# Altium schematic sheet HDMI_OUTPUT_AD9389.SchDoc: HDMI Video Transmitter
size A4; Organization: Altium Limited.; Address1: Level 3, 12a Rodborough Rd; Address2: Frenchs Forest 2086; Address3: NSW; Address4: AUSTRALIA; DocumentNumber: 10; SheetNumber: 10; SheetTotal: 100
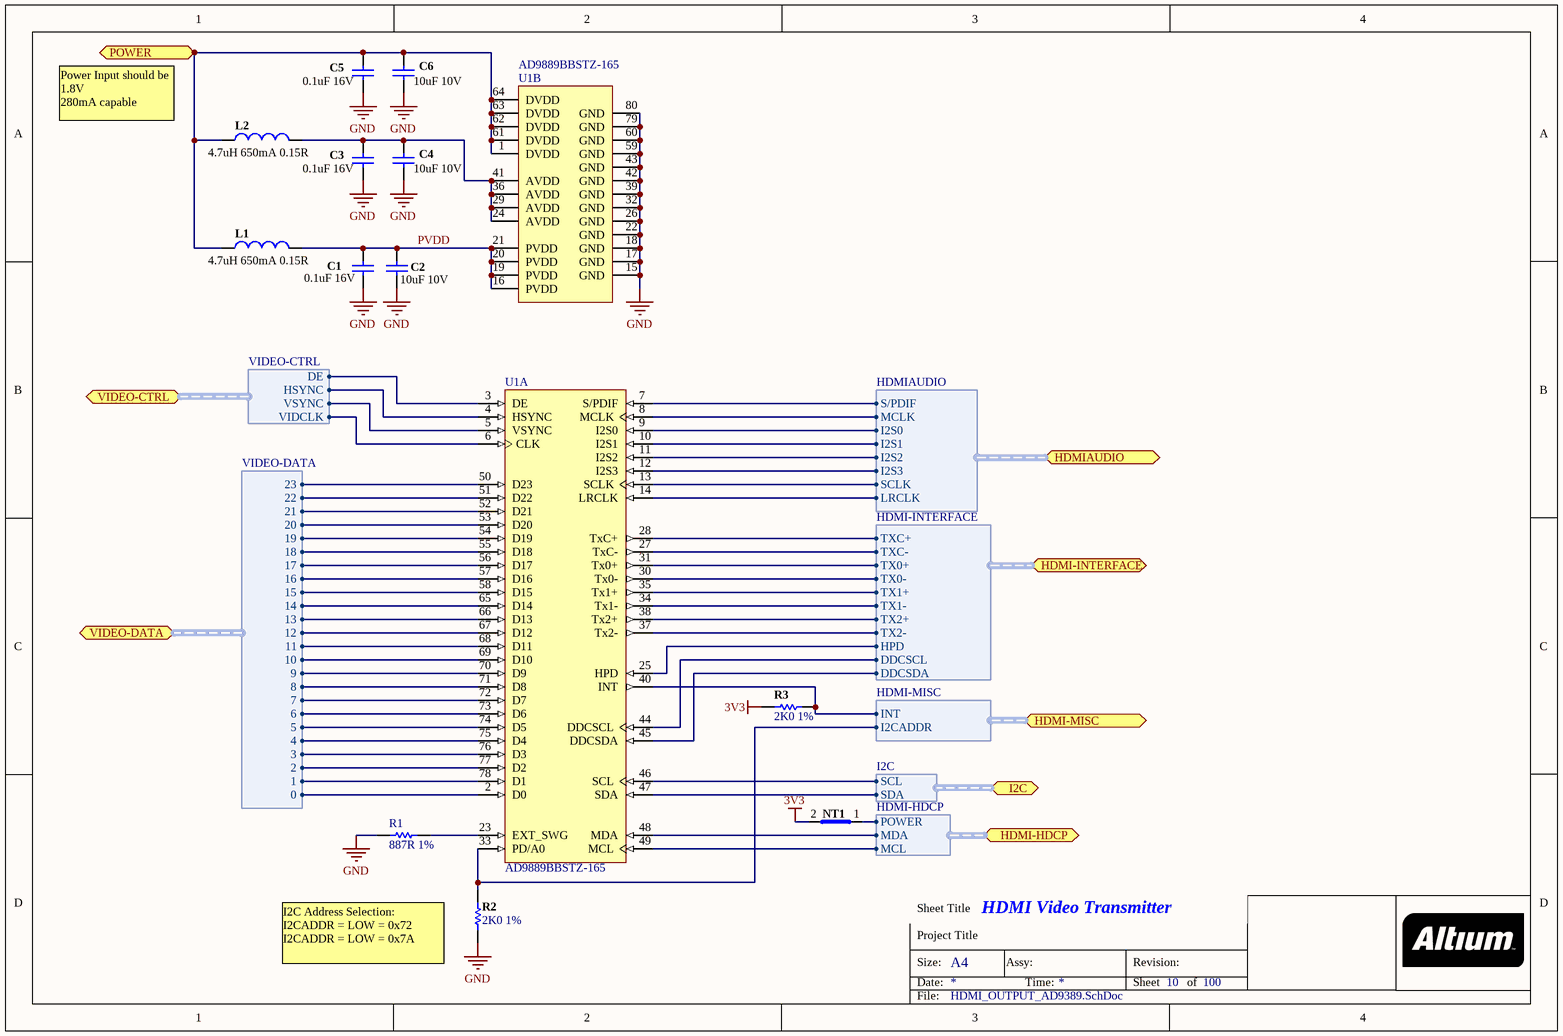
[diagram p0: HDMI_OUTPUT_AD9389.SchDoc]

## Parts
C1  0.1uF 16V  [CAPC1005-STAR]
C2  10uF 10V  [CAPC2012-STAR]
C3  0.1uF 16V  [CAPC1005-STAR]
C4  10uF 10V  [CAPC2012-STAR]
C5  0.1uF 16V  [CAPC1005-STAR]
C6  10uF 10V  [CAPC2012-STAR]
L1  4.7uH 650mA 0.15R  [INDC3225]
L2  4.7uH 650mA 0.15R  [INDC3225]
NT1  Net Tie SMT2  [NETTIE-SMT2-31X39]  (value not drawn)  (net tie, no BOM)
R1  887R 1%  [RESC1005-STAR]
R2  2K0 1%  [RESC1005-STAR]
R3  2K0 1%  [RESC1005-STAR]
U1  AD9889BBSTZ-165  [ST-80-2_V]  (parts A,B of 2)

## Ports
HDMI-HDCP (harness HDMI-HDCP), HDMI-INTERFACE (harness HDMI-INTERFACE), HDMI-MISC (harness HDMI-MISC), HDMIAUDIO (harness HDMIAUDIO), I2C (harness I2C), POWER, VIDEO-CTRL (harness VIDEO-CTRL), VIDEO-DATA (harness VIDEO-DATA)

## Harnesses
I2C: SCL, SDA
HDMIAUDIO: I2S0, I2S1, I2S2, I2S3, LRCLK, MCLK, S/PDIF, SCLK
VIDEO-CTRL: DE, HSYNC, VIDCLK, VSYNC
VIDEO-DATA: 0, 1, 10, 11, 12, 13, 14, 15, 16, 17, 18, 19, 2, 20, 21, 22, 23, 3, 4, 5, 6, 7, 8, 9
HDMI-INTERFACE: TX0+, TX0-, TX1+, TX1-, TX2+, TX2-, TXC+, TXC-, DDCSDA, DDCSCL, HPD
HDMI-MISC: INT, I2CADDR
HDMI-HDCP: POWER, MCL, MDA

## Nets
3V3: NT1.2(Net2) R3.1
GND: C1.2 C2.2 C3.2 C4.2 C5.2 C6.2 R1.1 R2.2 U1.15(GND) U1.17(GND) U1.18(GND) U1.22(GND) U1.26(GND) U1.32(GND) U1.39(GND) U1.42(GND) U1.43(GND) U1.59(GND) U1.60(GND) U1.79(GND) U1.80(GND)
POWER: C5.1 C6.1 L1.1 L2.1 U1.1(DVDD) U1.61(DVDD) U1.62(DVDD) U1.63(DVDD) U1.64(DVDD) ; port POWER
PVDD: C1.1 C2.1 L1.2 U1.16(PVDD) U1.19(PVDD) U1.20(PVDD) U1.21(PVDD)
NetC3_1: C3.1 C4.1 L2.2 U1.24(AVDD) U1.29(AVDD) U1.36(AVDD) U1.41(AVDD)
NetNT1_1: NT1.1(Net1) ; port HDMI-HDCP.POWER
NetR1_2: R1.2 U1.23(EXT_SWG)
NetR2_1: R2.1 U1.33(PD/A0) ; port HDMI-MISC.I2CADDR
NetR3_2: R3.2 U1.40(INT) ; port HDMI-MISC.INT
NetU1_2: U1.2(D0) ; port VIDEO-DATA.0
NetU1_3: U1.3(DE) ; port VIDEO-CTRL.DE
NetU1_4: U1.4(HSYNC) ; port VIDEO-CTRL.HSYNC
NetU1_5: U1.5(VSYNC) ; port VIDEO-CTRL.VSYNC
NetU1_6: U1.6(CLK) ; port VIDEO-CTRL.VIDCLK
NetU1_7: U1.7(S/PDIF) ; port HDMIAUDIO.S/PDIF
NetU1_8: U1.8(MCLK) ; port HDMIAUDIO.MCLK
NetU1_9: U1.9(I2S0) ; port HDMIAUDIO.I2S0
NetU1_10: U1.10(I2S1) ; port HDMIAUDIO.I2S1
NetU1_11: U1.11(I2S2) ; port HDMIAUDIO.I2S2
NetU1_12: U1.12(I2S3) ; port HDMIAUDIO.I2S3
NetU1_13: U1.13(SCLK) ; port HDMIAUDIO.SCLK
NetU1_14: U1.14(LRCLK) ; port HDMIAUDIO.LRCLK
NetU1_25: U1.25(HPD) ; port HDMI-INTERFACE.HPD
NetU1_27: U1.27(TxC-) ; port HDMI-INTERFACE.TXC-
NetU1_28: U1.28(TxC+) ; port HDMI-INTERFACE.TXC+
NetU1_30: U1.30(Tx0-) ; port HDMI-INTERFACE.TX0-
NetU1_31: U1.31(Tx0+) ; port HDMI-INTERFACE.TX0+
NetU1_34: U1.34(Tx1-) ; port HDMI-INTERFACE.TX1-
NetU1_35: U1.35(Tx1+) ; port HDMI-INTERFACE.TX1+
NetU1_37: U1.37(Tx2-) ; port HDMI-INTERFACE.TX2-
NetU1_38: U1.38(Tx2+) ; port HDMI-INTERFACE.TX2+
NetU1_44: U1.44(DDCSCL) ; port HDMI-INTERFACE.DDCSCL
NetU1_45: U1.45(DDCSDA) ; port HDMI-INTERFACE.DDCSDA
NetU1_46: U1.46(SCL) ; port I2C.SCL
NetU1_47: U1.47(SDA) ; port I2C.SDA
NetU1_48: U1.48(MDA) ; port HDMI-HDCP.MDA
NetU1_49: U1.49(MCL) ; port HDMI-HDCP.MCL
NetU1_50: U1.50(D23) ; port VIDEO-DATA.23
NetU1_51: U1.51(D22) ; port VIDEO-DATA.22
NetU1_52: U1.52(D21) ; port VIDEO-DATA.21
NetU1_53: U1.53(D20) ; port VIDEO-DATA.20
NetU1_54: U1.54(D19) ; port VIDEO-DATA.19
NetU1_55: U1.55(D18) ; port VIDEO-DATA.18
NetU1_56: U1.56(D17) ; port VIDEO-DATA.17
NetU1_57: U1.57(D16) ; port VIDEO-DATA.16
NetU1_58: U1.58(D15) ; port VIDEO-DATA.15
NetU1_65: U1.65(D14) ; port VIDEO-DATA.14
NetU1_66: U1.66(D13) ; port VIDEO-DATA.13
NetU1_67: U1.67(D12) ; port VIDEO-DATA.12
NetU1_68: U1.68(D11) ; port VIDEO-DATA.11
NetU1_69: U1.69(D10) ; port VIDEO-DATA.10
NetU1_70: U1.70(D9) ; port VIDEO-DATA.9
NetU1_71: U1.71(D8) ; port VIDEO-DATA.8
NetU1_72: U1.72(D7) ; port VIDEO-DATA.7
NetU1_73: U1.73(D6) ; port VIDEO-DATA.6
NetU1_74: U1.74(D5) ; port VIDEO-DATA.5
NetU1_75: U1.75(D4) ; port VIDEO-DATA.4
NetU1_76: U1.76(D3) ; port VIDEO-DATA.3
NetU1_77: U1.77(D2) ; port VIDEO-DATA.2
NetU1_78: U1.78(D1) ; port VIDEO-DATA.1

## Notes on the sheet
- Power Input should be 1.8V
  280mA capable
- (near R2) I2C Address Selection:
  I2CADDR = LOW = 0x72
  I2CADDR = LOW = 0x7A
- Sheet Title
- Project Title
- Size:
- Date:
- A4
- Assy:
- Time:
- Revision:
- Sheet
- of
- File:

## Library data of the parts
C1 C3 C5 = D-101-0080: Capacitor, Ceramic, 0.1uF 10% 16V 0402 (1005) X7R; Polarity: Non-Polarized; Capacitance: 0.1 uF; Category: Capacitor; Dielectric: X7R; Mounting Technology: Surface Mount; Rated Voltage: 16 V; Status: Production; Technology: Ceramic; Tolerance: 10 %
C2 C4 C6 = D-101-0087: Capacitor, Ceramic, 10uF 10% 10V 0805 (2012) X5R; Polarity: Non-Polarized; Capacitance: 10 uF; Category: Capacitor; Dielectric: X5R; Mounting Technology: Surface Mount; Rated Voltage: 10 V; Status: Unreleased; Technology: None; Tolerance: 10 %
L1 L2 = D-102-0005: Inductor, 4.7uH 650mA 0.15R 1210 (3225) LQH32CN4R7M11L; Category: Inductor; Status: Production
NT1 = D-002-0004: Net-Tie, Surface Mount, 2 x 2.0mm x 0.8mm SMT Pads - For 0.8mm Track; Status: Production; Category: Net-Tie
R1 = D-100-0148: Resistor, 887R 1% 0402 (1005); Power Rating: 63 mW; Mounting Technology: Surface Mount; Resistance: 887 R; Status: Production; Tolerance: 1 %; Category: Resistor
R2 R3 = D-100-0139: Resistor, 2K0 1% 0402 (1005); Power Rating: 63 mW; Resistance: 2.0 K; Mounting Technology: Surface Mount; Status: Unreleased; Tolerance: 1 %; Category: Resistor
U1 = D-202-0004: AD9889, HDMI Video Transmitter, TQFP; Supply Voltage: mV; Mounting Technology: Surface Mount; Status: Production; Category: IC-Video